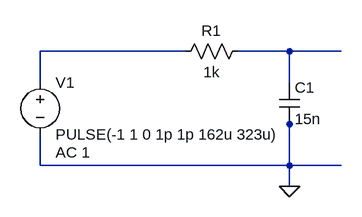
[diagram p0: schematic RC.asc]
RC.asc, the LTspice schematic file:
Version 4
SHEET 1 880 680
WIRE -144 48 -368 48
WIRE 16 48 -64 48
WIRE 96 48 16 48
WIRE -368 96 -368 48
WIRE 16 96 16 48
WIRE 16 160 16 144
WIRE -368 224 -368 176
WIRE 16 224 16 160
WIRE 16 224 -368 224
WIRE 96 224 16 224
WIRE 16 256 16 224
FLAG 16 256 0
SYMBOL voltage -368 80 R0
WINDOW 123 24 124 Left 2
WINDOW 39 0 0 Left 2
SYMATTR Value2 AC 1
SYMATTR InstName V1
SYMATTR Value PULSE(-1 1 0 1p 1p 162u 323u)
SYMBOL res -48 32 R90
WINDOW 0 0 56 VBottom 2
WINDOW 3 32 56 VTop 2
SYMATTR InstName R1
SYMATTR Value 1k
SYMBOL cap 0 96 R0
SYMATTR InstName C1
SYMATTR Value 15n

The netlist it stands for:
* RC.asc
V1 N001 0 PULSE(-1 1 0 1p 1p 162u 323u) AC 1
R1 N002 N001 1k
C1 N002 0 15n
.backanno
.end